# Altium project NES-NROM-256.PrjPCB
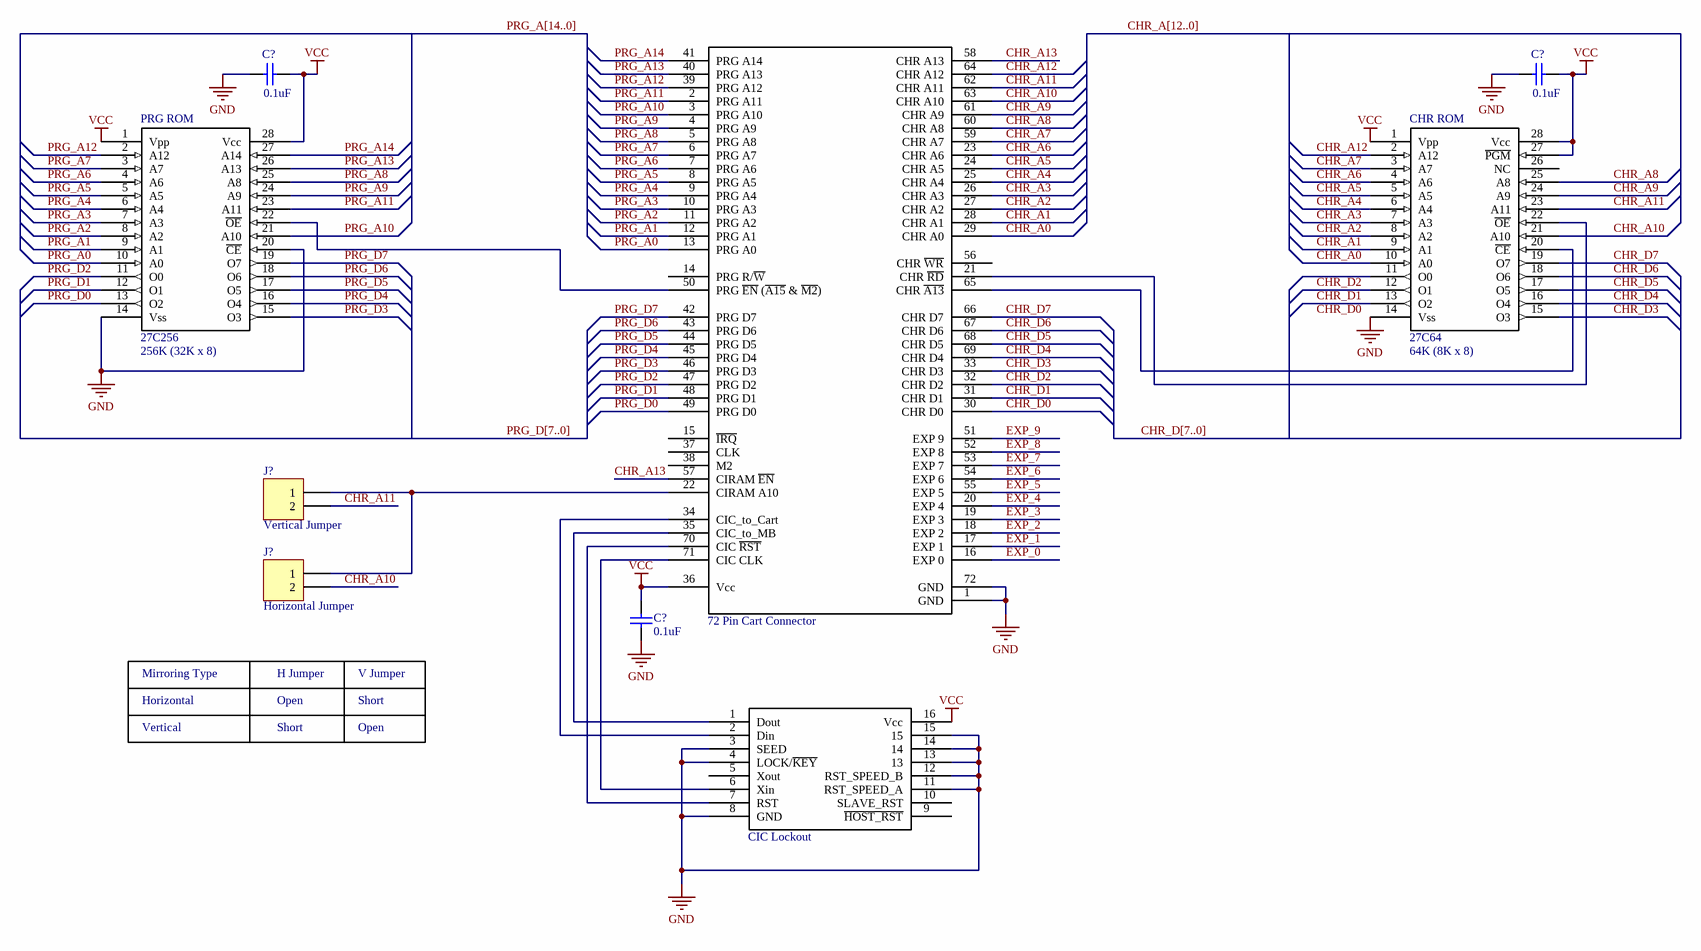
[diagram p0: NES-NROM-256.SchDoc]
1 sheet, 9 parts. Net scope: global (net labels, ports and power ports of the same name join across sheets).
Board file: NES-NROM-256 PCB.PcbDoc

## Sheet NES-NROM-256.SchDoc: NES-NROM-256 Cartridge
size Tabloid; DrawnBy: M. Spinks; Revision: 1.0; SheetNumber: 1; SheetTotal: 1; PageSetup: Record=PageOptions|CenterHorizontal=True|CenterVertical=True|PrintScale=0.98|XCorrection=1.00|YCorrection=1.00|PrintKind=1|BorderSize=5000000|LeftOffset=0|BottomOffset=0|Orientation=2|PaperLength=1000|PaperWidth=1000|Scale=100|PaperSource=7|PrintQuality=-4|MediaType=1|DitherType=10|PaperKind=Tabloid|PrintScaleMode=1

### Parts
(Parts that share a designator on the sheet are numbered #1, #2 ... from top to bottom, then left to right.)
C?#1  value 0.1uF  [C1206]  (hidden comment: Cap Semi)
C?#2  value 0.1uF  [C1206]  (hidden comment: Cap Semi)
C?#3  value 0.1uF  [C1206]  (hidden comment: Cap Semi)
CHR_ROM  27C64  Memory Size: 64K (8K x 8)  [DIP600-JW28 EPROM w/ window]
J1  72 Pin Cart Connector  [72 Pin Cart]
J?#1  Vertical Jumper  [HDR1X2]
J?#2  Horizontal Jumper  [HDR1X2]
PRG_ROM  27C256  Memory Size: 256K (32K x 8)  [DIP600-JW28 EPROM w/ window]
U1  CIC Lockout  [DIP16]

### Nets
GND: C?#1.1 C?#2.1 C?#3.1 CHR_ROM.14(Vss) J1.1(GND) J1.72(GND) PRG_ROM.14(Vss) PRG_ROM.20(~{CE}) U1.3(SEED) U1.4(LOCK/~{KEY}) U1.8(GND) U1.11(RST_SPEED_A) U1.12(RST_SPEED_B) U1.13 U1.14 U1.15
VCC: C?#1.2 C?#2.2 C?#3.2 CHR_ROM.1(Vpp) CHR_ROM.27(~{PGM}) CHR_ROM.28(Vcc) J1.36(Vcc) PRG_ROM.1(Vpp) PRG_ROM.28(Vcc) U1.16(Vcc)
CHR_A0: CHR_ROM.10(A0) J1.29(CHR_A0)
CHR_A1: CHR_ROM.9(A1) J1.28(CHR_A1)
CHR_A2: CHR_ROM.8(A2) J1.27(CHR_A2)
CHR_A3: CHR_ROM.7(A3) J1.26(CHR_A3)
CHR_A4: CHR_ROM.6(A4) J1.25(CHR_A4)
CHR_A5: CHR_ROM.5(A5) J1.24(CHR_A5)
CHR_A6: CHR_ROM.4(A6) J1.23(CHR_A6)
CHR_A7: CHR_ROM.3(A7) J1.59(CHR_A7)
CHR_A8: CHR_ROM.25(A8) J1.60(CHR_A8)
CHR_A9: CHR_ROM.24(A9) J1.61(CHR_A9)
CHR_A10: CHR_ROM.21(A10) J1.63(CHR_A10) J?#2.2
CHR_A11: CHR_ROM.23(A11) J1.62(CHR_A11) J?#1.2
CHR_A12: CHR_ROM.2(A12) J1.64(CHR_A12)
CHR_A13: J1.57(CIRAM_~{EN}) J1.58(CHR_A13)
CHR_D0: J1.30(CHR_D0)
CHR_D1: CHR_ROM.13(O2) J1.31(CHR_D1)
CHR_D2: CHR_ROM.12(O1) J1.32(CHR_D2)
CHR_D3: CHR_ROM.15(O3) J1.33(CHR_D3)
CHR_D4: CHR_ROM.16(O4) J1.69(CHR_D4)
CHR_D5: CHR_ROM.17(O5) J1.68(CHR_D5)
CHR_D6: CHR_ROM.18(O6) J1.67(CHR_D6)
CHR_D7: CHR_ROM.19(O7) J1.66(CHR_D7)
EXP_0: J1.16(EXP_0)
EXP_1: J1.17(EXP_1)
EXP_2: J1.18(EXP_2)
EXP_3: J1.19(EXP_3)
EXP_4: J1.20(EXP_4)
EXP_5: J1.55(EXP_5)
EXP_6: J1.54(EXP_6)
EXP_7: J1.53(EXP_7)
EXP_8: J1.52(EXP_8)
EXP_9: J1.51(EXP_9)
PRG_A0: J1.13(PRG_A0) PRG_ROM.10(A0)
PRG_A1: J1.12(PRG_A1) PRG_ROM.9(A1)
PRG_A2: J1.11(PRG_A2) PRG_ROM.8(A2)
PRG_A3: J1.10(PRG_A3) PRG_ROM.7(A3)
PRG_A4: J1.9(PRG_A4) PRG_ROM.6(A4)
PRG_A5: J1.8(PRG_A5) PRG_ROM.5(A5)
PRG_A6: J1.7(PRG_A6) PRG_ROM.4(A6)
PRG_A7: J1.6(PRG_A7) PRG_ROM.3(A7)
PRG_A8: J1.5(PRG_A8) PRG_ROM.25(A8)
PRG_A9: J1.4(PRG_A9) PRG_ROM.24(A9)
PRG_A10: J1.3(PRG_A10) PRG_ROM.21(A10)
PRG_A11: J1.2(PRG_A11) PRG_ROM.23(A11)
PRG_A12: J1.39(PRG_A12) PRG_ROM.2(A12)
PRG_A13: J1.40(PRG_A13) PRG_ROM.26(A13)
PRG_A14: J1.41(PRG_A14) PRG_ROM.27(A14)
PRG_D0: J1.49(PRG_D0) PRG_ROM.13(O2)
PRG_D1: J1.48(PRG_D1) PRG_ROM.12(O1)
PRG_D2: J1.47(PRG_D2) PRG_ROM.11(O0)
PRG_D3: J1.46(PRG_D3) PRG_ROM.15(O3)
PRG_D4: J1.45(PRG_D4) PRG_ROM.16(O4)
PRG_D5: J1.44(PRG_D5) PRG_ROM.17(O5)
PRG_D6: J1.43(PRG_D6) PRG_ROM.18(O6)
PRG_D7: J1.42(PRG_D7) PRG_ROM.19(O7)
NetCHR_ROM_20: CHR_ROM.20(~{CE}) J1.65(CHR_~{A13})
NetCHR_ROM_22: CHR_ROM.22(~{OE}) J1.21(CHR_~{RD})
NetJ1_22: J1.22(CIRAM_A10) J?#1.1 J?#2.1
NetJ1_34: J1.34(CIC_to_Cart) U1.2(Din)
NetJ1_35: J1.35(CIC_to_MB) U1.1(Dout)
NetJ1_50: J1.50(PRG_~{EN}_(~{A15}_&_~{M2})) PRG_ROM.22(~{OE})
NetJ1_70: J1.70(CIC_~{RST}) U1.7(RST)
NetJ1_71: J1.71(CIC_CLK) U1.6(Xin)

Not connected (* = marked no-connect by the designer): CHR_ROM 11(O0) 26(NC); J1 14(PRG_R/~{W}) 15(~{IRQ}) 37(CLK) 38(M2) 56(CHR_~{WR}); U1 5(Xout) 9(~{HOST_RST}) 10(SLAVE_RST)

### Buses and harness runs
bus CHR_A[12..0]
bus CHR_D[7..0]
bus PRG_A[14..0]
bus PRG_D[7..0]

### Notes on the sheet
- Mirroring Type
- H Jumper
- V Jumper
- Horizontal
- Vertical
- Open
- Short
- Labels drawn without touching a wire or pin: CHR_D0
- Title
- Size:
- Date:
- Ledger
- Drawn By:
- Time:
- Revision:
- Sheet
- of
- File:

### Library data of the parts
C?#1-C?#3 = Cap Semi: Capacitor (Semiconductor SIM Model); Published: 8-Jun-2000; LatestRevisionDate: 29-May-2009; LatestRevisionNote: IPC-7351 Footprint Added.; PackageReference: C1206; Publisher: Altium Limited; PackageDescription: Chip Capacitor
CHR_ROM = 27C64: 64K bit (8K x 8) EPROM - 28 pin
J1 = 72 Pin Cart: 72 Pin Cartridge Connector
J?#1 J?#2 = Header 2: Header, 2-Pin; LatestRevisionDate: 17-Jul-2002; LatestRevisionNote: Re-released for DXP Platform.; Publisher: Altium Limited
PRG_ROM = 27C256: 256K bit (32K x 8) EPROM - 28 pin
U1 = CIC: 10NES CIC Lockout Chip